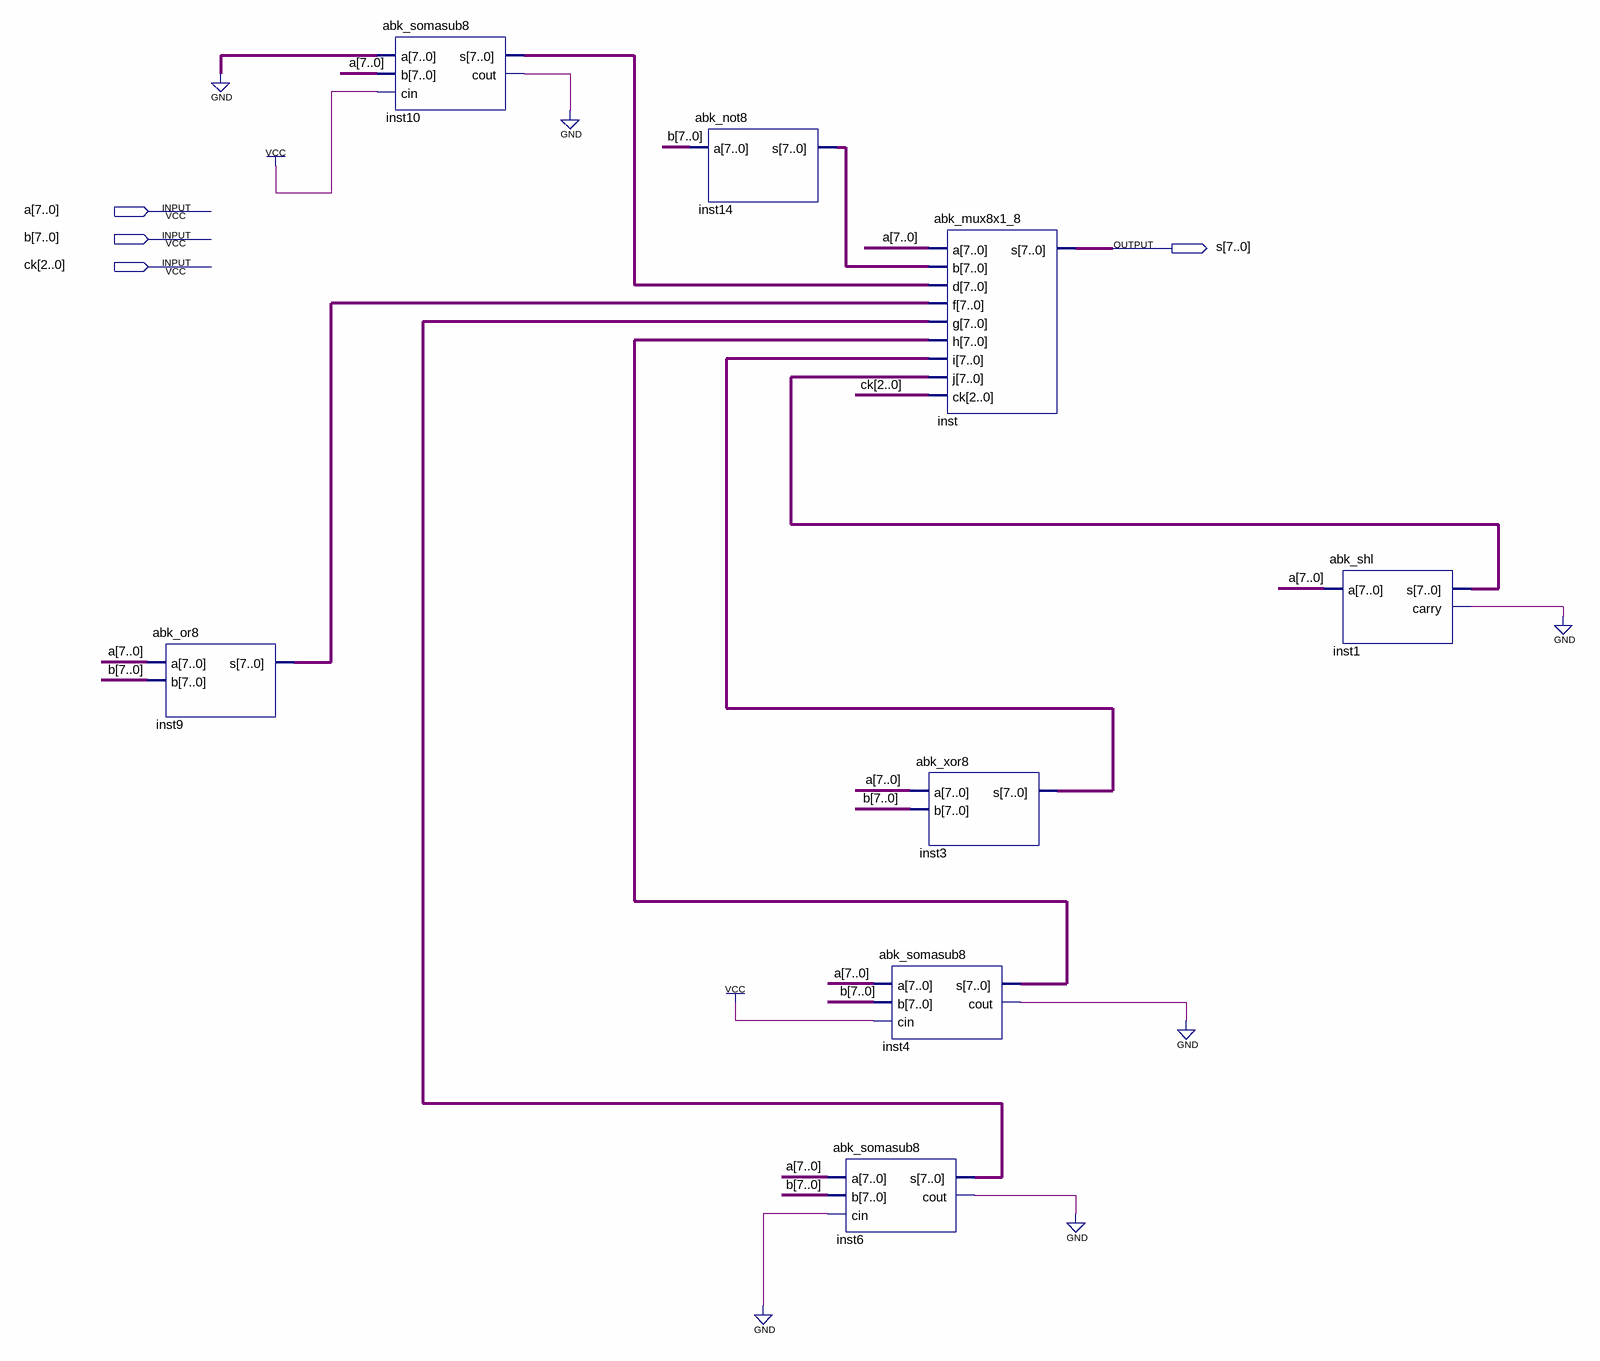
[diagram p0: schematic sheet]
// Quartus schematic abk_ula_gen.bdf as structural Verilog: 8 symbols, 4 pins
module abk_ula_gen (
  input  [7:0] a,
  input  [7:0] b,
  input  [2:0] ck,
  output [7:0] s
);

  wire inst1_carry, inst4_cout, inst6_cout, inst10_cout;
  wire [7:0] inst1_s, inst3_s, inst4_s, inst6_s, inst9_s, inst10_s, inst14_s;

  abk_or8 inst9 (.a(a), .b(b), .s(inst9_s));
  abk_somasub8 inst10 (.a({8{1'b0}}), .b(a), .cin(1'b1), .s(inst10_s), .cout(inst10_cout));
  abk_not8 inst14 (.a(b), .s(inst14_s));
  abk_somasub8 inst4 (.a(a), .b(b), .cin(1'b1), .s(inst4_s), .cout(inst4_cout));
  abk_somasub8 inst6 (.a(a), .b(b), .cin(1'b0), .s(inst6_s), .cout(inst6_cout));
  abk_mux8x1_8 inst (
    .a(a), .b(inst14_s), .d(inst10_s), .f(inst9_s), .g(inst6_s), .h(inst4_s), .i(inst3_s), .j(inst1_s),
    .ck(ck), .s(s));
  abk_xor8 inst3 (.a(a), .b(b), .s(inst3_s));
  abk_shl inst1 (.a(a), .s(inst1_s), .carry(inst1_carry));
  // also tied to GND on the sheet: {inst1_carry, inst6_cout, inst4_cout, inst10_cout}
endmodule
